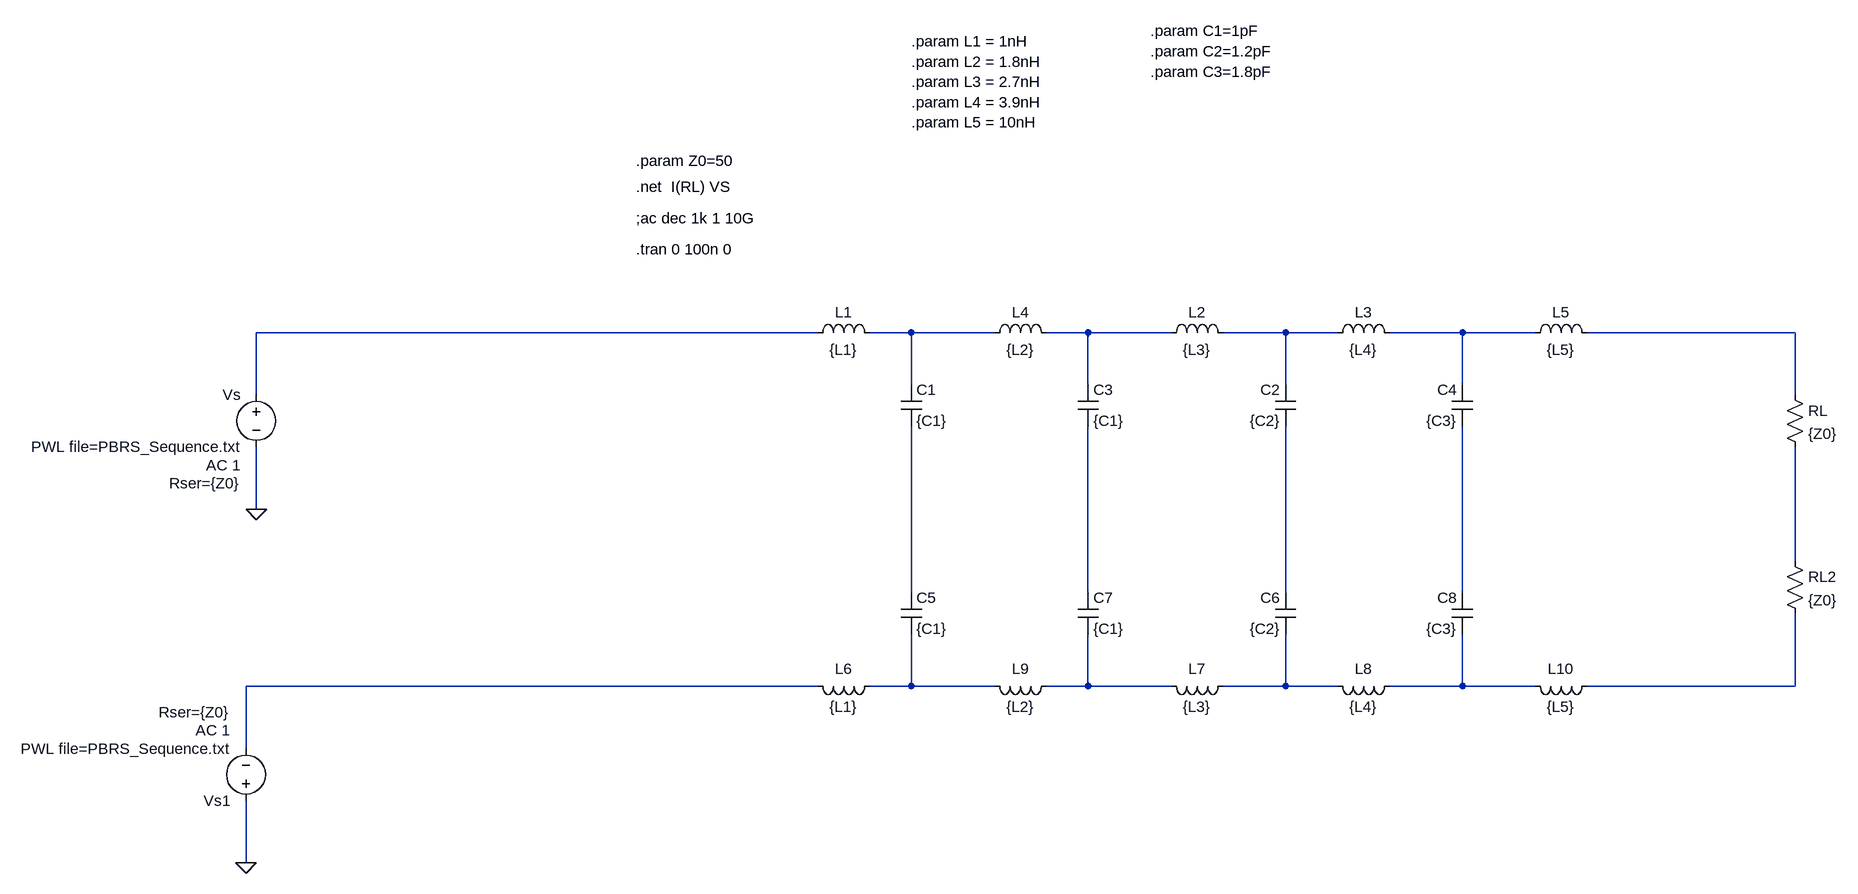
[diagram p0: schematic 1p75GHz_9th_Order_Bessel_Pulse_Shaping_Filter.asc]
1p75GHz_9th_Order_Bessel_Pulse_Shaping_Filter.asc, the LTspice schematic file:
Version 4
SHEET 1 1792 740
WIRE 208 -96 -656 -96
WIRE 352 -96 288 -96
WIRE 480 -96 352 -96
WIRE 624 -96 560 -96
WIRE 752 -96 624 -96
WIRE 928 -96 832 -96
WIRE 1008 -96 928 -96
WIRE 1200 -96 1088 -96
WIRE 1312 -96 1200 -96
WIRE 1712 -96 1392 -96
WIRE 352 -16 352 -96
WIRE 624 -16 624 -96
WIRE 928 -16 928 -96
WIRE 1200 -16 1200 -96
WIRE -656 0 -656 -96
WIRE 1712 0 1712 -96
WIRE -656 176 -656 80
WIRE 1712 256 1712 80
WIRE 352 304 352 48
WIRE 624 304 624 48
WIRE 928 304 928 48
WIRE 1200 304 1200 48
WIRE 208 448 -672 448
WIRE 352 448 352 368
WIRE 352 448 288 448
WIRE 480 448 352 448
WIRE 624 448 624 368
WIRE 624 448 560 448
WIRE 752 448 624 448
WIRE 928 448 928 368
WIRE 928 448 832 448
WIRE 1008 448 928 448
WIRE 1200 448 1200 368
WIRE 1200 448 1088 448
WIRE 1312 448 1200 448
WIRE 1712 448 1712 336
WIRE 1712 448 1392 448
WIRE -672 544 -672 448
WIRE -672 720 -672 624
FLAG -656 176 0
FLAG -672 720 0
SYMBOL voltage -656 -16 M0
WINDOW 123 24 124 Left 2
WINDOW 39 24 152 Left 2
SYMATTR Value2 AC 1
SYMATTR SpiceLine Rser={Z0}
SYMATTR InstName Vs
SYMATTR Value PWL file=PBRS_Sequence.txt
SYMBOL ind 192 -80 R270
WINDOW 0 32 56 VTop 2
WINDOW 3 5 56 VBottom 2
SYMATTR InstName L1
SYMATTR Value {L1}
SYMBOL cap 336 -16 R0
SYMATTR InstName C1
SYMATTR Value {C1}
SYMBOL ind 736 -80 R270
WINDOW 0 32 56 VTop 2
WINDOW 3 5 56 VBottom 2
SYMATTR InstName L2
SYMATTR Value {L3}
SYMBOL res 1696 -16 R0
SYMATTR InstName RL
SYMATTR Value {Z0}
SYMBOL ind 1104 -80 M270
WINDOW 0 32 56 VTop 2
WINDOW 3 5 56 VBottom 2
SYMATTR InstName L3
SYMATTR Value {L4}
SYMBOL cap 944 -16 M0
SYMATTR InstName C2
SYMATTR Value {C2}
SYMBOL ind 464 -80 R270
WINDOW 0 32 56 VTop 2
WINDOW 3 5 56 VBottom 2
SYMATTR InstName L4
SYMATTR Value {L2}
SYMBOL cap 608 -16 R0
SYMATTR InstName C3
SYMATTR Value {C1}
SYMBOL ind 1408 -80 M270
WINDOW 0 32 56 VTop 2
WINDOW 3 5 56 VBottom 2
SYMATTR InstName L5
SYMATTR Value {L5}
SYMBOL cap 1216 -16 M0
SYMATTR InstName C4
SYMATTR Value {C3}
SYMBOL ind 192 432 M90
WINDOW 0 5 56 VBottom 2
WINDOW 3 32 56 VTop 2
SYMATTR InstName L6
SYMATTR Value {L1}
SYMBOL cap 336 368 M180
WINDOW 0 24 56 Left 2
WINDOW 3 24 8 Left 2
SYMATTR InstName C5
SYMATTR Value {C1}
SYMBOL ind 736 432 M90
WINDOW 0 5 56 VBottom 2
WINDOW 3 32 56 VTop 2
SYMATTR InstName L7
SYMATTR Value {L3}
SYMBOL ind 1104 432 R90
WINDOW 0 5 56 VBottom 2
WINDOW 3 32 56 VTop 2
SYMATTR InstName L8
SYMATTR Value {L4}
SYMBOL cap 944 368 R180
WINDOW 0 24 56 Left 2
WINDOW 3 24 8 Left 2
SYMATTR InstName C6
SYMATTR Value {C2}
SYMBOL ind 464 432 M90
WINDOW 0 5 56 VBottom 2
WINDOW 3 32 56 VTop 2
SYMATTR InstName L9
SYMATTR Value {L2}
SYMBOL cap 608 368 M180
WINDOW 0 24 56 Left 2
WINDOW 3 24 8 Left 2
SYMATTR InstName C7
SYMATTR Value {C1}
SYMBOL ind 1408 432 R90
WINDOW 0 5 56 VBottom 2
WINDOW 3 32 56 VTop 2
SYMATTR InstName L10
SYMATTR Value {L5}
SYMBOL cap 1216 368 R180
WINDOW 0 24 56 Left 2
WINDOW 3 24 8 Left 2
SYMATTR InstName C8
SYMATTR Value {C3}
SYMBOL voltage -672 640 R180
WINDOW 123 24 124 Left 2
WINDOW 39 24 152 Left 2
SYMATTR Value2 AC 1
SYMATTR SpiceLine Rser={Z0}
SYMATTR InstName Vs1
SYMATTR Value PWL file=PBRS_Sequence.txt
SYMBOL res 1696 240 R0
SYMATTR InstName RL2
SYMATTR Value {Z0}
TEXT -72 -320 Left 2 !.net  I(RL) VS
TEXT -72 -360 Left 2 !.param Z0=50
TEXT -72 -272 Left 2 !;ac dec 1k 1 10G
TEXT -72 -224 Left 2 !.tran 0 100n 0
TEXT 352 -544 Left 2 !.param L1 = 1nH\n.param L2 = 1.8nH\n.param L3 = 2.7nH\n.param L4 = 3.9nH\n.param L5 = 10nH
TEXT 720 -560 Left 2 !.param C1=1pF\n.param C2=1.2pF\n.param C3=1.8pF

The netlist it stands for:
* 1p75GHz_9th_Order_Bessel_Pulse_Shaping_Filter.asc
Vs N001 0 PWL file=PBRS_Sequence.txt AC 1 Rser={Z0}
L1 N001 N002 {L1}
C1 N002 N008 {C1}
L2 N003 N004 {L3}
RL N006 N007 {Z0}
L3 N005 N004 {L4}
C2 N004 N010 {C2}
L4 N002 N003 {L2}
C3 N003 N009 {C1}
L5 N006 N005 {L5}
C4 N005 N011 {C3}
L6 N012 N013 {L1}
C5 N013 N008 {C1}
L7 N014 N015 {L3}
L8 N016 N015 {L4}
C6 N015 N010 {C2}
L9 N013 N014 {L2}
C7 N014 N009 {C1}
L10 N017 N016 {L5}
C8 N016 N011 {C3}
Vs1 0 N012 PWL file=PBRS_Sequence.txt AC 1 Rser={Z0}
RL2 N007 N017 {Z0}
.net  I(RL) VS
.param Z0=50
;ac dec 1k 1 10G
.tran 0 100n 0
.param L1 = 1nH
.param L2 = 1.8nH
.param L3 = 2.7nH
.param L4 = 3.9nH
.param L5 = 10nH
.param C1=1pF
.param C2=1.2pF
.param C3=1.8pF
.backanno
.end